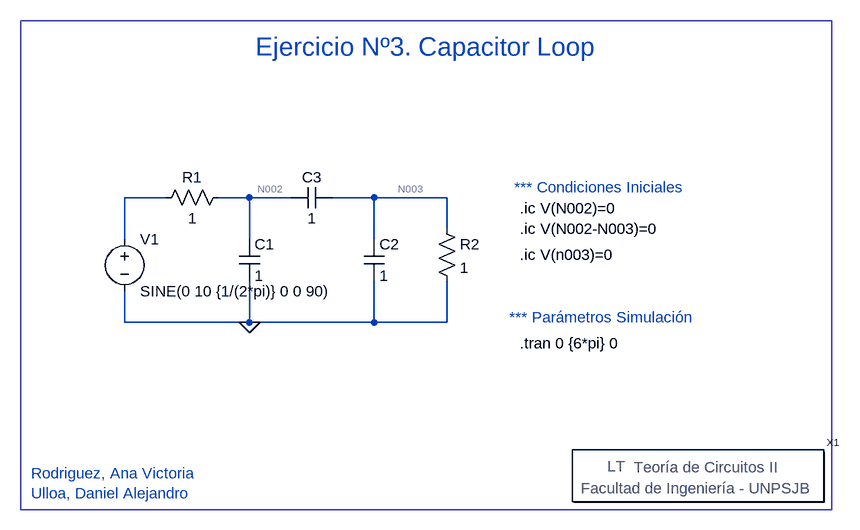
[diagram p0: schematic 03.asc]
03.asc, the LTspice schematic file:
Version 4
SHEET 1 880 680
WIRE -176 -48 -240 -48
WIRE -48 -48 -96 -48
WIRE 16 -48 -48 -48
WIRE 144 -48 80 -48
WIRE 256 -48 144 -48
WIRE 256 0 256 -48
WIRE -240 16 -240 -48
WIRE -48 16 -48 -48
WIRE 144 16 144 -48
WIRE -240 144 -240 96
WIRE -48 144 -48 80
WIRE -48 144 -240 144
WIRE 144 144 144 80
WIRE 144 144 -48 144
WIRE 256 144 256 80
WIRE 256 144 144 144
FLAG -48 144 0
SYMBOL Circuitos2\\Letreros\\Teoría\ de\ Circuitos\ II 640 384 R0
SYMATTR InstName X1
SYMBOL voltage -240 0 R0
WINDOW 123 0 0 Left 0
WINDOW 39 0 0 Left 0
SYMATTR InstName V1
SYMATTR Value SINE(0 10 {1/(2*pi)} 0 0 90)
SYMBOL res -80 -64 R90
WINDOW 0 0 56 VBottom 2
WINDOW 3 32 56 VTop 2
SYMATTR InstName R1
SYMATTR Value 1
SYMBOL cap -64 16 R0
SYMATTR InstName C1
SYMATTR Value 1
SYMBOL res 240 -16 R0
SYMATTR InstName R2
SYMATTR Value 1
SYMBOL cap 128 16 R0
SYMATTR InstName C2
SYMATTR Value 1
SYMBOL cap 80 -64 R90
WINDOW 0 0 32 VBottom 2
WINDOW 3 32 32 VTop 2
SYMATTR InstName C3
SYMATTR Value 1
TEXT 224 -280 Center 4 ;Ejercicio Nº3. Capacitor Loop
TEXT -384 376 Left 2 ;Rodriguez, Ana Victoria\nUlloa, Daniel Alejandro
TEXT 360 -64 Left 2 ;*** Condiciones Iniciales
TEXT 352 136 Left 2 ;*** Parámetros Simulación
TEXT 368 -32 Left 2 !.ic V(N002)=0
TEXT 368 176 Left 2 !.tran 0 {6*pi} 0
TEXT 368 0 Left 2 !.ic V(N002-N003)=0
TEXT 368 40 Left 2 !.ic V(n003)=0
RECTANGLE Normal 848 432 -400 -320

The netlist it stands for:
* 03.asc
XX1 Teoría de Circuitos II
V1 N001 0 SINE(0 10 {1/(2*pi)} 0 0 90)
R1 N002 N001 1
C1 N002 0 1
R2 N003 0 1
C2 N003 0 1
C3 N003 N002 1
* Ejercicio Nº3. Capacitor Loop
* Rodriguez, Ana Victoria
* Ulloa, Daniel Alejandro
* *** Condiciones Iniciales
* *** Parámetros Simulación
.ic V(N002)=0
.tran 0 {6*pi} 0
.ic V(N002-N003)=0
.ic V(n003)=0
.backanno
.end